# EAGLE design IRBeaconRev4 (EAGLE 6.4)
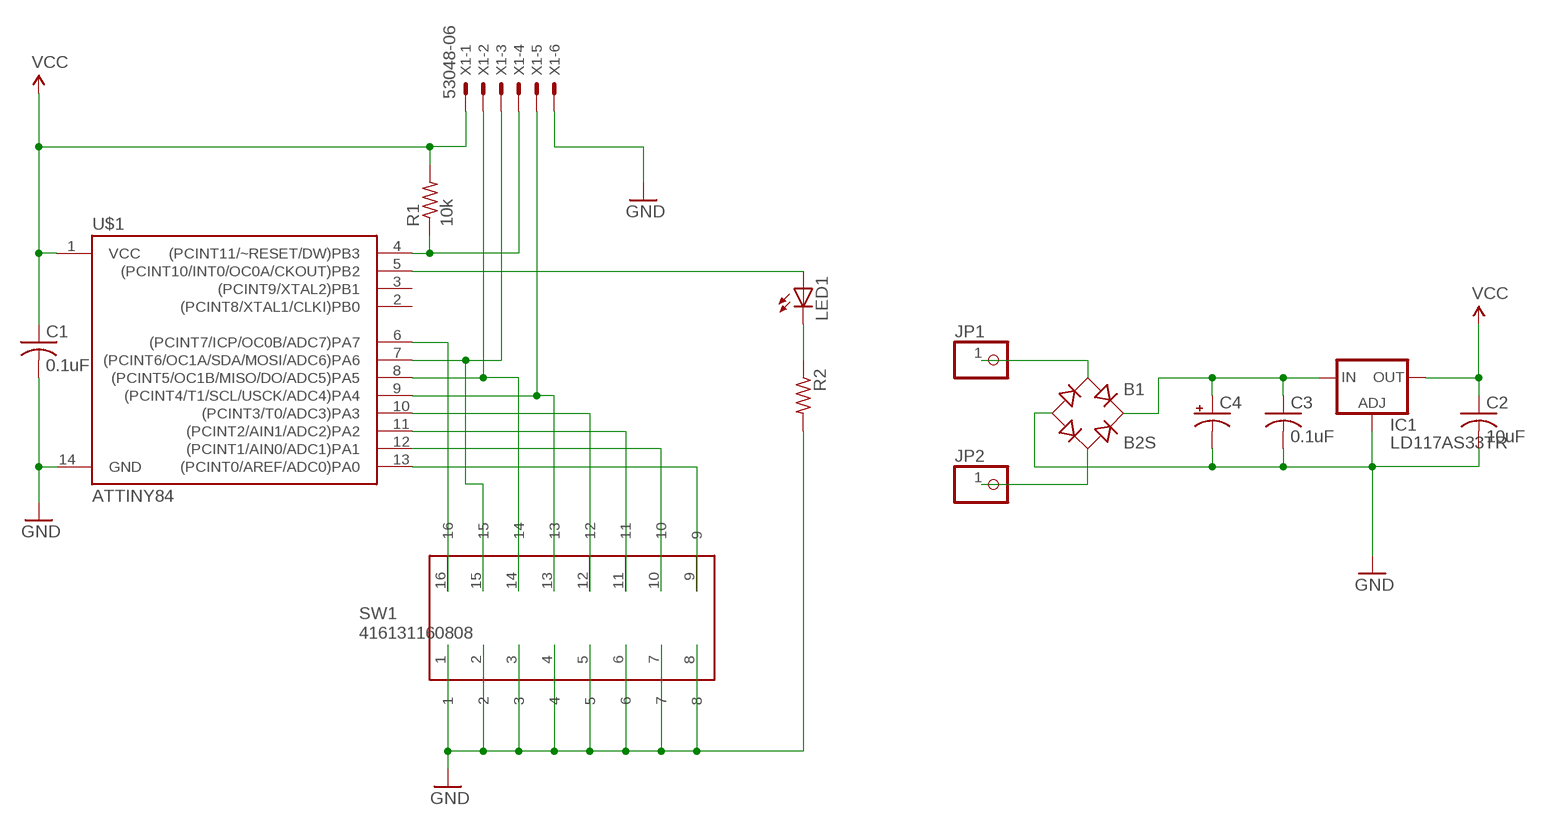
[diagram p0: schematic, sheet 1]

## Parts
B1  B2S  [MBS]
C1  0.1uF  C-USC0805  [C0805]
C2  10uF  C-USC0805  [C0805]
C3  0.1uF  C-USC0805  [C0805]
C4  CAP_POLPTH4  [CPOL-RADIAL-1000UF-25V]
IC1  LD117AS33TR  [SOT223]
JP1  PINHD-1X1  [1X01]
JP2  PINHD-1X1  [1X01]
LED1  LEDCHIPLED_1206  [CHIPLED_1206]
R1  10k  R-US_R0805  [R0805]
R2  R-US_R0805  [R0805]
SW1  416131160808  [416131160808]
U$1  ATTINY84  [SO14]
X1  53048-06  [53048-06]

## Nets
GND: B1.- C1.2 C2.2 C3.2 C4.2(-) IC1.1(ADJ) R2.2 SW1.1 SW1.2 SW1.3 SW1.4 SW1.5 SW1.6 SW1.7 SW1.8 U$1.14(GND) X1.6
N$1: R1.1 U$1.4((PCINT11/~RESET/DW)PB3) X1.4
N$2: B1.AC2 JP2.1
N$3: B1.+ C3.1 C4.1(+) IC1.3(IN)
N$4: SW1.12 U$1.10((PCINT3/T0/ADC3)PA3)
N$5: SW1.11 U$1.11((PCINT2/AIN1/ADC2)PA2)
N$6: SW1.10 U$1.12((PCINT1/AIN0/ADC1)PA1)
N$7: LED1.A U$1.5((PCINT10/INT0/OC0A/CKOUT)PB2)
N$8: SW1.13 U$1.9((PCINT4/T1/SCL/USCK/ADC4)PA4) X1.5
N$9: SW1.9 U$1.13((PCINT0/AREF/ADC0)PA0)
N$10: SW1.15 U$1.7((PCINT6/OC1A/SDA/MOSI/ADC6)PA6) X1.3
N$12: SW1.14 U$1.8((PCINT5/OC1B/MISO/DO/ADC5)PA5) X1.2
N$13: LED1.C R2.1
N$16: SW1.16 U$1.6((PCINT7/ICP/OC0B/ADC7)PA7)
RAIL_A: B1.AC1 JP1.1
VCC: C1.1 C2.1 IC1.4(OUT) R1.2 U$1.1(VCC) X1.1
Unconnected: U$1.2((PCINT8/XTAL1/CLKI)PB0) U$1.3((PCINT9/XTAL2)PB1)

## Library data of the parts
B1 = rectifier:B*S: Surface Mount Glass Passivated Bridge Rectifiers Source: Comchip Bridge Rectifiers B05S-G_B10S-G.pdf
C1-C3 = rcl:C-US: CAPACITOR, American symbol
C4 = SparkFun-Capacitors:CAP_POL: Capacitor Polarized These are standard SMD and PTH capacitors. Normally 10uF, 47uF, and 100uF in electrolytic and tantalum varieties. Always verify the external diameter of the through hole cap, it varies with capacity, voltage, and manufacturer. The EIA devices should be standard.
IC1 = v-reg:LD117A?*: Low drop fixed and adjustable positive voltage regulators 1 A Source: http://www.st.com/stonline/products/literature/ds/7194/ld1117axx.pdf
JP1 JP2 = adafruit:PINHD-1X1: Pin header 1x1 for 0.1" spacing With round pins
LED1 = adafruit:LED: LED OSRAM: - CHIPLED LG R971, LG N971, LY N971, LG Q971, LY Q971, LO R971, LY R971 LH N974, LH R974 LS Q976, LO Q976, LY Q976 LO Q996 - Hyper CHIPLED LW Q18S LB Q993, LB Q99A, LB R99A - SideLED LS A670, LO A670, LY A670, LG A670, LP A670 LB A673, LV A673, LT A673, LW A673 LH A674 LY A675 LS A676, LA A676, LO A676, LY A676, LW A676 LS A679, LY A679, LG A679 - Hyper Micro SIDELED® LS Y876, LA Y876, LO Y876, LY Y876 LT Y87S - SmartLED LW L88C, LW L88S LB L89C, LB L89S, LG L890 LS L89K, LO L89K, LY L89K LS L896, LA L896, LO L896, LY L896 - TOPLED LS T670, LO T670, LY T670, LG T670, LP T670 LSG T670, LSP T670, LSY T670, LOP T670, LYG T670 LG T671, LOG T671, LSG T671 LB T673, LV T673, LT T673, LW T673 LH T674 LS T676, LA T676, LO T676, LY T676, LB T676, LH T676, LSB T676, LW T676 LB T67C, LV T67C, LT T67C, LS T67K, LO T67K, LY T67K, LW E67C LS E67B, LA E67B, LO E67B, LY E67B, LB E67C, LV E67C, LT E67C LW T67C LS T679, LY T679, LG T679 LS T770, LO T770, LY T770, LG T770, LP T770 LB T773, LV T773, LT T773, LW T773 LH T774 LS E675, LA E675, LY E675, LS T675 LS T776, LA T776, LO T776, LY T776, LB T776 LHGB T686 LT T68C, LB T68C - Hyper Mini TOPLED® LB M676 - Mini TOPLED Santana® LG M470 LS M47K, LO M47K, LY M47K Source: http://www.osram.convergy.de/
R1 R2 = rcl:R-US_: RESISTOR, American symbol
SW1 = DipSchalter:416131160808: WS-HP-1.27 mm small compact SMD Dip Switch with top tape,16 pins,8 poles
U$1 = SparkFun-DigitalIC:ATTINY84: Atmel 14-pin 2/4/8kB flash uC
X1 = con-molex:53?-06: CONNECTOR wire to board 1.25 mm (.049 inch) pitch header; MF: WALDOM/MOLEX; MPN: 53048-0610; OC_FARNELL: 1012260; OC_NEWARK: 38C9911

## Net classes
0 default: clearance 0.508 mm

## Board
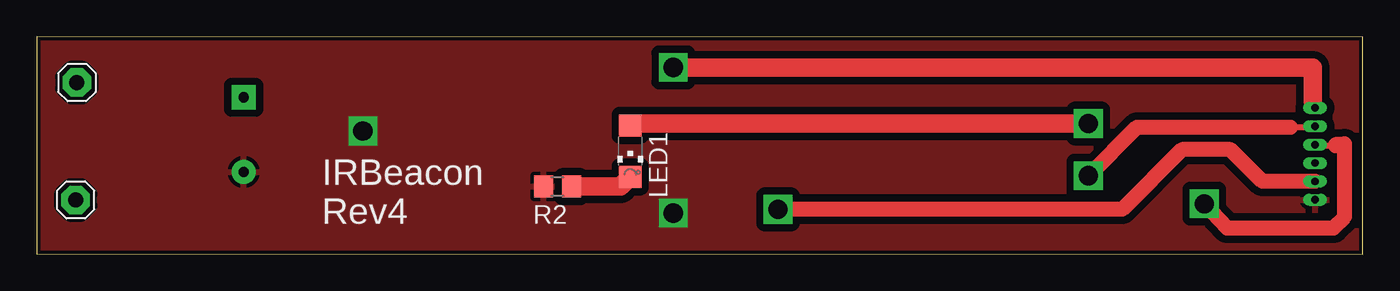
[diagram p1: board, top side]
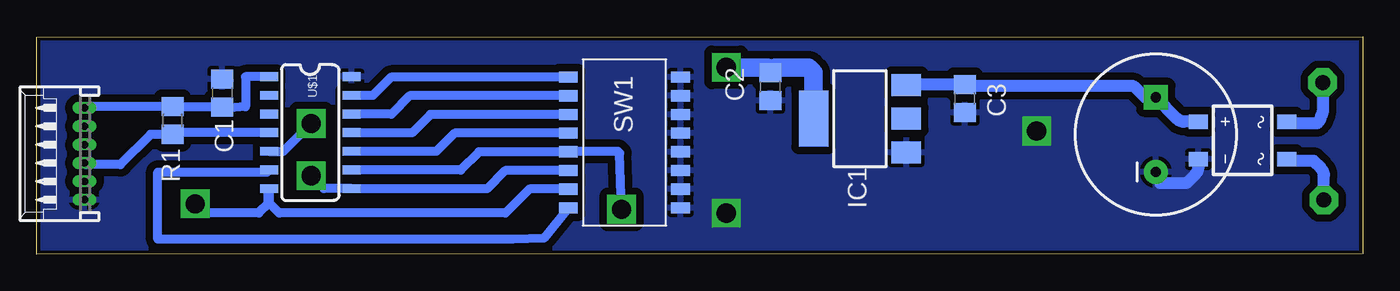
[diagram p2: board, bottom side, seen from below]

Size 90.05 x 14.79 mm. Coordinates in mm from the lower left corner, seen from the top.
Outline: 0,0.04 90.05,0 90.05,14.75 0,14.79 0,0.04
Copper layers (1*16): Top 0.035mm / dielectric 0.2mm / Bottom 0.035mm
Design rules "SeeedStudio_DRU_no_angle_20130527": minimum track width 6mil, minimum drill 12mil, track to track 6mil, track to pad 6mil, pad to pad 6mil, via to via 6mil, smd to smd 0mil, copper to edge 10mil, drill to drill 10mil, minimum pad ring 6mil, minimum via ring 6mil, stop-mask expansion 2mil, vias tented up to drill 25mil, thermal gap 10mil

### Footprints (pad centres in the part's own frame; a part is rotated, then mirrored left to right if it is on the bottom)
MBS = smd 1 x 1.3: + -1.27,-3; - 1.27,-3; AC1 -1.27,3; AC2 1.27,3
C0805 = smd 1.3 x 1.5: 1 -0.95,0; 2 0.95,0
CPOL-RADIAL-1000UF-25V = drill 0.7 pad 1.651 square: 1 2.54,0 | drill 0.7 pad 1.651: 2 -2.54,0
SOT223 = smd 1.5 x 2: 1 -2.3,-3.15; 2 0,-3.15; 3 2.3,-3.15 | smd 3.8 x 2: 4 0,3.15
1X01 = drill 1.016 pad 1.93 octagon: 1 0,0
CHIPLED_1206 = smd 1.5 x 1.5: A 0,-1.75; C 0,1.75
R0805 = smd 1.3 x 1.5: 1 -0.95,0; 2 0.95,0
416131160808 = smd 0.76 x 1.27: 1 0,-3.81; 2 1.27,-3.81; 3 2.54,-3.81; 4 3.81,-3.81; 5 5.08,-3.81; 6 6.35,-3.81; 7 7.62,-3.81; 8 8.89,-3.81; 9 8.89,3.81; 10 7.62,3.81; 11 6.35,3.81; 12 5.08,3.81; 13 3.81,3.81; 14 2.54,3.81; 15 1.27,3.81; 16 0,3.81
SO14 = smd 0.6 x 1.2: 1 -3.81,-2.8; 2 -2.54,-2.8; 3 -1.27,-2.8; 4 0,-2.8; 5 1.27,-2.8; 6 2.54,-2.8; 7 3.81,-2.8; 8 3.81,2.8; 9 2.54,2.8; 10 1.27,2.8; 11 0,2.8; 12 -1.27,2.8; 13 -2.54,2.8; 14 -3.81,2.8
53048-06 = drill 0.5 pad 0.698 long: 1 3.125,-1.25; 2 1.875,-1.25; 3 0.625,-1.25; 4 -0.625,-1.25; 5 -1.875,-1.25; 6 -3.125,-1.25

### Placement (x,y rotation side)
B1  8.16,7.73 270 bottom
C1  77.45,10.96 90 bottom
C2  40.23,11.39 270 bottom
C3  27.02,10.59 270 bottom
C4  14.05,8.13 90 bottom
IC1  34.15,9.21 90 bottom
JP1  2.72,11.67 0 top
JP2  2.64,3.69 180 top
LED1  40.31,7.01 180 top
R1  80.83,9.1 90 bottom
R2  35.36,4.6 180 top
SW1  50.14,3.15 90 bottom
U$1  71.47,8.27 270 bottom
X1  88.07,6.83 90 bottom

### Tracks (layer width: path | path; a pad name or v marks a point on that pad's centre or on a via)
GND  (via drill 1.3)
  Bottom 0.813: B1.- 11.16,5.91 arc45 11.35,5.46 11.99,4.83 13.77,4.83 13.77,5.04 arc-45 13.95,5.49 C4.2
  other vias: 43.23,2.79 22.15,8.38
  pour Top: -0.19,14.98 90.3,15.49 90.05,0 0.07,-0.76
  pour Bottom: 0.07,15.24 91.3,15.24 91.05,0.02 0.05,0.02 0.07,1.02
N$1
  Bottom 0.61: X1.4 86.72,6.1 84.38,6.1 82.32,8.15 R1.1 80.71,8.27 U$1.4
N$2
  Bottom 0.813: JP2.1 2.64,5.38 arc-45 2.83,5.82 3.35,6.35 4.89,6.35 arc45 B1.AC2
N$3
  Bottom 0.813: B1.+ 12.12,9 arc45 12.57,9.19 C4.1 14.78,10.67 15.54,11.43 26.91,11.43 C3.1 30.96,11.54 IC1.3
N$4
  Bottom 0.61: SW1.12 61.67,8.23 62.91,6.99 68.66,6.99 U$1.10
N$5
  Bottom 0.61: SW1.11 63.32,9.5 64.57,8.26 68.66,8.26 U$1.11
N$6
  Bottom 0.61: SW1.10 64.72,10.77 65.96,9.53 68.66,9.53 U$1.12
N$7  (via drill 1.3)
  Top 1.27: v71.42,8.89 40.43,8.89 LED1.A
  Bottom 0.61: U$1.5 73.32,7 v71.42,8.89
N$8  (via drill 1.3)
  Top 1.016: X1.5 83.24,4.95 81.08,7.11 77.77,7.11 73.71,3.05 v50.34,3.05
  Bottom 0.61: U$1.9 68.66,5.71 61.26,5.71 60.02,6.96 SW1.13 53.92,6.99 50.6,6.99 50.47,6.86 v50.34,3.05
N$9
  Bottom 0.61: SW1.9 65.99,12.04 67.23,10.79 68.66,10.79 U$1.13
N$10  (via drill 1.3)
  Top 0.406: 88.19,7.37 86.82,7.37 X1.3
  Top 1.016: v79.3,3.43 80.82,1.78 88.06,1.78 88.82,2.54 88.82,7.45 | 88.82,7.45 88.82,7.49 | 88.82,7.45 88.19,7.45 88.19,7.37
  Bottom 0.61: SW1.15 56.59,4.42 58.22,2.79 73.58,2.79 74.34,3.56 74.34,4.38 U$1.7 74.27,3.5 74.98,2.79 78.66,2.79 v79.3,3.43
N$12  (via drill 1.3)
  Top 0.406: 85.14,8.64 86.82,8.64
  Top 0.61: 86.82,8.64 X1.2
  Top 1.016: v71.42,5.33 74.73,8.64 85.14,8.64
  Bottom 0.61: SW1.14 58.24,5.69 59.49,4.45 68.66,4.45 U$1.8 70.55,4.46 v71.42,5.33
N$13
  Top 1.27: R2.1 39.64,4.6 LED1.C
N$16
  Bottom 0.61: SW1.16 55.6,1.09 57.71,1.02 81.84,1.02 81.84,5.59 74.41,5.59 U$1.6
RAIL_A
  Bottom 0.813: JP1.1 2.72,9.7 arc45 2.84,9.4 arc45 3.02,8.96 3.1,8.89 4.89,8.89 arc45 B1.AC1
VCC  (via drill 1.3)
  Top 0.61: 86.66,10.41 86.66,10.11 X1.1
  Top 1.27: v43.23,12.7 86.66,12.7 86.66,10.41
  Bottom 0.61: C1.1 77.16,10.01 77.01,10.16 | U$1.1 75.48,12.08 75.87,12.06 75.87,10.03 77.35,9.91 C1.1 | C1.1 80.78,10.01 R1.2 86.72,10.05 X1.1
  Bottom 0.813: 40.49,12.65 40.44,12.7
  Bottom 1.27: IC1.4 37.3,12.35 37.64,12.7 39.88,12.7 C2.1 | C2.1 40.23,12.4 40.49,12.65 | v43.23,12.7 40.44,12.7 40.44,12.55 C2.1

### Text on the board
tNames: IRBeacon / Rev4